# Altium schematic sheet Scheme_UPS_RPI.SchDoc
size 420 x 297 mm; CheckedBy: Артемасов; Author: Лихачев; CompanyName: ВУЦ УРФУ; Address1: Address1; Address2: Address2; Address3: Address3; Address4: Address4; DocumentNumber: АРВЦ-431421.001 Э3; SheetNumber: 1; SheetTotal: 1; Scale: 1:1; Title2str: Источник бесперебойного; DocumentType: Схема электрическая принципиальная; FirstReferrence: ВУЦ-431421.001
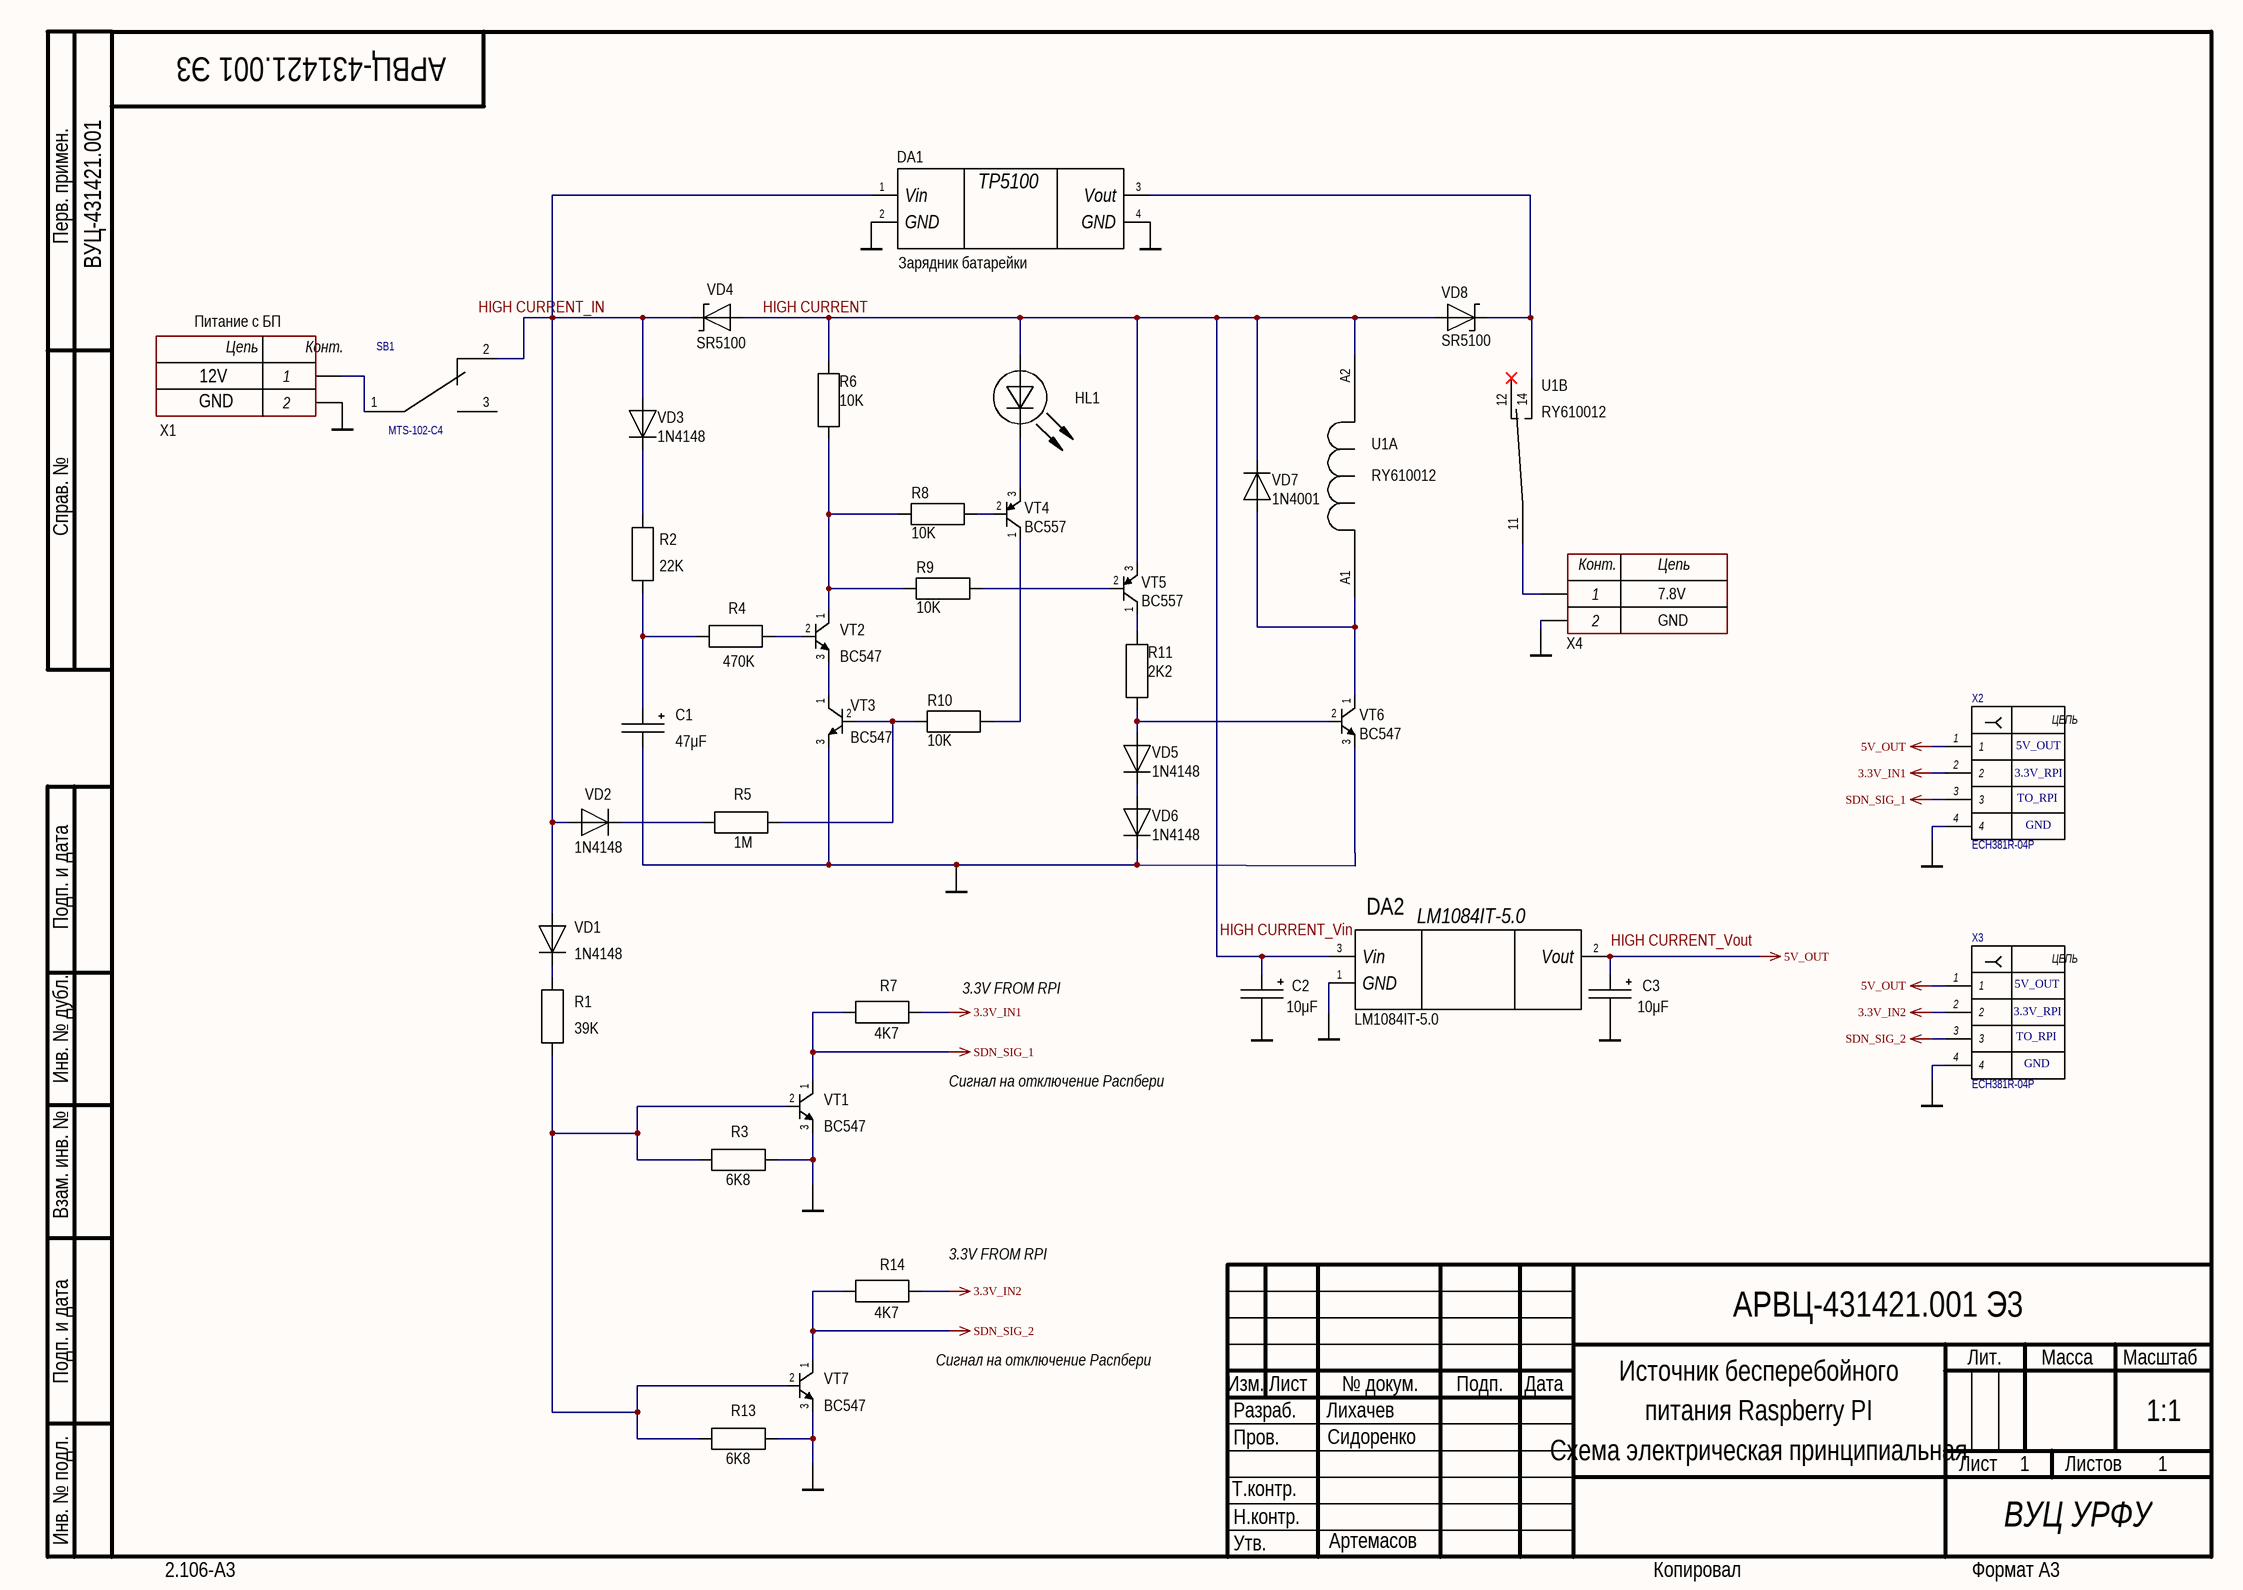
[diagram p0: Scheme_UPS_RPI.SchDoc]

## Parts
C1  value 47μF  [CAP 5*11]
C2  value 10μF  [CAP 5*11]
C3  value 10μF  [CAP 5*11]
DA1  Зарядник батарейки  [Зарядник батарейки]
DA2  LM1084IT-5.0  [Под_провода_для_LM]
HL1  (no value)  [LED 1206]
R1  value 39K  [Резисторы]
R2  value 22K  [Резисторы]
R3  value 6K8  [RES: 1206]
R4  value 470K  [Резисторы]
R5  value 1M  [Резисторы]
R6  value 10K  [Резисторы]
R7  value 4K7  [RES: 1206]
R8  value 10K  [Резисторы]
R9  value 10K  [Резисторы]
R10  value 10K  [Резисторы]
R11  value 2K2  [Резисторы]
R13  value 6K8  [RES: 1206]
R14  value 4K7  [RES: 1206]
SB1  MTS-102-C4  [MTS-102-C4]
U1  RY610012  [RELAY-SPDT_3.2mm]  (parts A,B of 2)
VD1  (no value)  [1N4148 DO-35]
VD2  (no value)  [1N4148 DO-35]
VD3  (no value)  [1N4148 DO-35]
VD4  (no value)  [Диод Шоттки SR5100]
VD5  (no value)  [1N4148 DO-35]
VD6  (no value)  [1N4148 DO-35]
VD7  (no value)  [1N4001 DO-41]
VD8  (no value)  [Диод Шоттки SR5100]
VT1  (no value)  [TO92]
VT2  (no value)  [TO92]
VT3  (no value)  [TO92]
VT4  (no value)  [TO92]
VT5  (no value)  [TO92]
VT6  (no value)  [TO92]
VT7  (no value)  [TO92]
X1  Питание с БП  [KLS2-EDV-5.08-02P-4]
X2  ECH381R-04P  [ECH381R-04P (KLS2-EDR-3.81-04P-4)]
X3  ECH381R-04P  [ECH381R-04P (KLS2-EDR-3.81-04P-4)]
X4  (no value)  [KLS2-EDV-5.08-02P-4]

## Nets
3.3V_IN1: R7.2 X2.2
3.3V_IN2: R14.2 X3.2
5V_OUT: C3.1 DA2.2(Vout) X2.1 X3.1
GND: C1.2 C2.2 C3.2 DA1.2(GND) DA1.4(GND) DA2.1(GND) R3.2 R13.2 VD6.2 VT1.3(E) VT3.3(E) VT6.3(E) VT7.3(E) X1.2 X2.4 X3.4 X4.2
SDN_SIG_1: R7.1 VT1.1(C) X2.3
SDN_SIG_2: R14.1 VT7.1(C) X3.3
HIGH CURRENT: C2.1 DA2.3(Vin) HL1.1(A) R6.2 U1.A2 VD4.2 VD7.2 VD8.2 VT5.3(E)
NetC1_1: C1.1 R2.1 R4.1
NetDA1_1: DA1.1(Vin) SB1.2 VD1.1 VD2.1 VD3.1 VD4.1
NetDA1_3: DA1.3(Vout) U1.14 VD8.1
NetHL1_2: HL1.2(C) VT4.3(E)
NetR1_1: R1.1 R3.1 R13.1 VT1.2(B) VT7.2(B)
NetR1_2: R1.2 VD1.2
NetR2_2: R2.2 VD3.2
NetR4_2: R4.2 VT2.2(B)
NetR5_1: R5.1 VD2.2
NetR5_2: R5.2 R10.1 VT3.2(B)
NetR6_1: R6.1 R8.1 R9.1 VT2.1(C)
NetR8_2: R8.2 VT4.2(B)
NetR9_2: R9.2 VT5.2(B)
NetR10_2: R10.2 VT4.1(C)
NetR11_1: R11.1 VD5.1 VT6.2(B)
NetR11_2: R11.2 VT5.1(C)
NetSB1_1: SB1.1 X1.1
NetU1_11: U1.11 X4.1
NetU1_A1: U1.A1 VD7.1 VT6.1(C)
NetVD5_2: VD5.2 VD6.1
NetVT2_3: VT2.3(E) VT3.1(C)

Not connected (* = marked no-connect by the designer): SB1 3; U1 12*

## Notes on the sheet
- Перв. примен.
- 12V
- GND
- Справ. №
- (near X2) 3.3V_RPI
- (near X2) 5V_OUT
- (near X2) TO_RPI
- (near X2) GND
- Подп. и дата
- 3.3V FROM RPI
- (near X3) 5V_OUT
- (near X3) 3.3V_RPI
- (near X3) TO_RPI
- (near X3) GND
- Инв. № дубл.
- Сигнал на отключение Распбери
- Взам. инв. №
- (near R14) 3.3V FROM RPI
- Разраб.
- Изм.
- Лист
- № докум.
- Подп.
- Дата
- питания Raspberry PI
- Лит.
- Масса
- Масштаб
- Пров.
- Сидоренко
- Листов
- Инв. № подл.
- Т.контр.
- Утв.
- Н.контр.
- 2.106-A3
- Копировал
- Формат А3
- Labels drawn without touching a wire or pin: HIGH CURRENT_IN, HIGH CURRENT_Vin, HIGH CURRENT_Vout
- (in symbol CONNECTOR 2 PIN) Цепь; Конт.
- (in symbol ECH381R-04P) ЦЕПЬ
- (in symbol Держатель батарейки) Конт.; Цепь; 7.8V; GND
- (in symbol Зарядник батарейки) TP5100

## Library data of the parts
C1-C3 = POLAR CAPACITOR
HL1 = LED_single
R1-R11 R13 R14 = RESISTOR
U1 = RY610012: No Description Available; Vendor: TE Connectivity; Built_By: EMA_UL_Team; SourceLibrary: Tyco_2012-1-03; Manufacturer_Part_Number: RY610012; Copyright: Copyright (C) 2016 Accelerated Designs. All rights reserved; RefDes: RefDes; Type: DEV
VD1-VD3 VD5 VD6 = 1N4148: PartNumber: 1N4148
VD4 VD8 = SR5100: Manufacturer: Diodes Incorporated; Package: DO-27; PartNumber: SR5100
VD7 = 1N4001: Manufacturer: Micro Commercial; ValueManufacturerPartNumber: Single diode, 75V, 150mA, 1V, 4ns, SOD-323, -55...+150°C; TypeDiode: Single diode; Voltage: 75V; Current: 150mA; VoltageDrop: 1V; RecoveryTime: 4ns; Package: SOD-323; HelpURL: https://www.digikey.com/product-detail/en/micro-commercial-co/1N4148WX-TP/1N4148WXTPMSCT-ND/717312; Temperature: -55...+150°C; PartNumber: 1N4001
VT1-VT3 VT6 VT7 = BC547: Manufacturer: ON Semiconductor; ValueManufacturerPartNumber: NPN transistor, 45V, 100mA, 100MHz, 300mW, 0.6V, 420, SOT-23, -55...+125°C; TypeTransistor: NPN transistor; VoltageCE: 45V; CurrentCE: 100mA; VoltageSaturation: 0.6V; Frequency: 100MHz; CurrentGain: 420; MaxPower: 300mW; PartNumber: BC547; Package: SOT-23; HelpURL: https://www.digikey.com/product-detail/en/on-semiconductor/BC847CLT1G/BC847CLT1GOSCT-ND/917836; Temperature: -55...+125°C
VT4 VT5 = BC557: Manufacturer: ON Semiconductor; ValueManufacturerPartNumber: PNP transistor, 45V, 100mA, 100MHz, 300mW, 0.65V, 220, SOT-23, -55...+125°C; TypeTransistor: PNP transistor; VoltageCE: 45V; CurrentCE: 100mA; VoltageSaturation: 0.65V; Frequency: 100MHz; CurrentGain: 220; MaxPower: 300mW; PartNumber: BC557; Package: SOT-23; HelpURL: https://www.digikey.com/product-detail/en/on-semiconductor/BC857BLT3G/BC857BLT3GOSCT-ND/2704963; Temperature: -55...+125°C
X1 = CONNECTOR 2 PIN
X2 X3 = ECH381R-04P: 4-pin R connector
X4 = Держатель батарейки